# Altium project controller_V1.3.PrjPcb
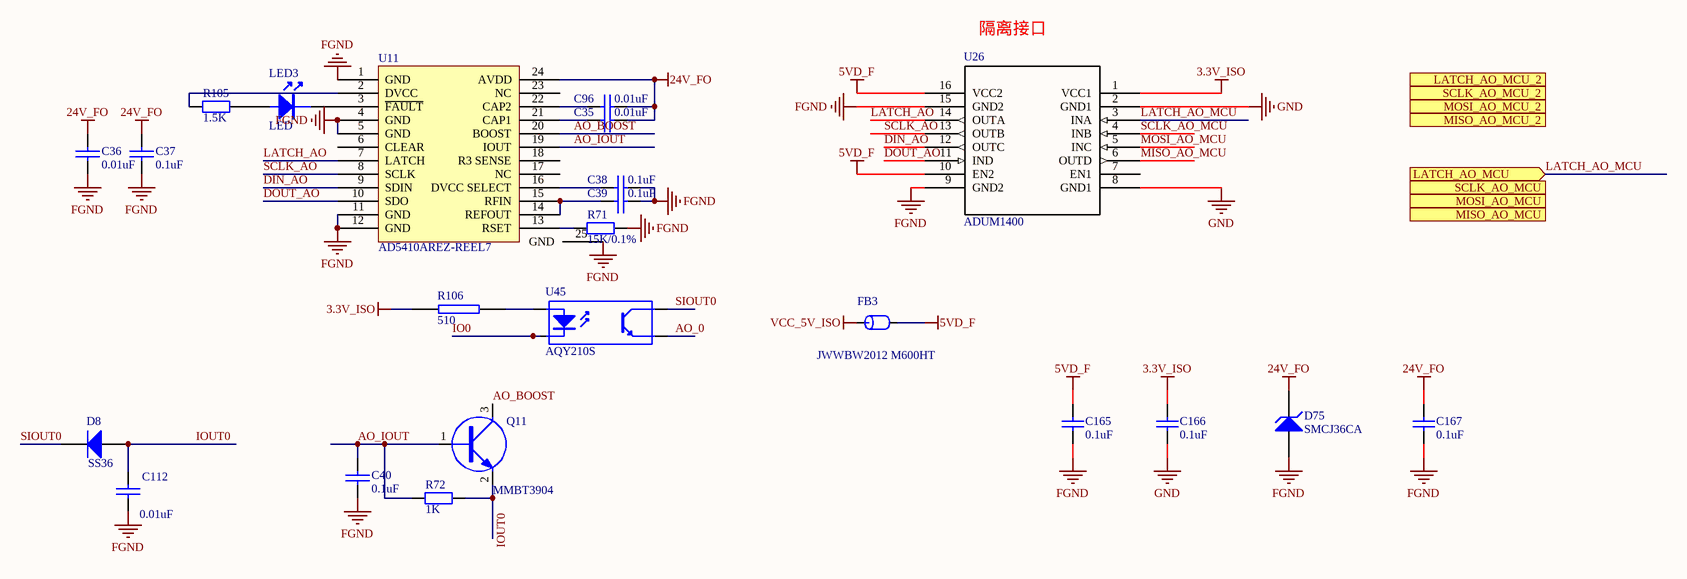
[diagram p0: ao.SchDoc]
5 sheets, 115 parts. Net scope: global (net labels, ports and power ports of the same name join across sheets).
Board file: controller_V1.3.PcbDoc
Sheets:
  ao.SchDoc
  mcu.SchDoc
  pt100.SchDoc
  wire.SchDoc
  power1.SchDoc

## Sheet ao.SchDoc
size A3

### Parts
C35  0.01uF  [0603C]  (no BOM)
C36  0.01uF  [0603C]  (no BOM)
C37  0.1uF  [0603C]  (no BOM)
C38  0.1uF  [0603C]  (no BOM)
C39  0.1uF  [0603C]  (no BOM)
C40  0.1uF  [0603C]  (no BOM)
C96  0.01uF  [0603C]  (no BOM)
C112  0.01uF  [0603C]  (no BOM)
C165  0.1uF  [0603C]  (no BOM)
C166  0.1uF  [0603C]  (no BOM)
C167  0.1uF  [0603C]  (no BOM)
D8  SS36  [sma]  (no BOM)
D75  SMCJ36CA  [SMC]  (no BOM)
FB3  JWWBW2012 M600HT  [0805R]  (no BOM)
LED3  LED  [0603LED]  (no BOM)
Q11  MMBT3904  [SOT23-3]  (no BOM)
R71  15K/0.1%  [0603R]  (no BOM)
R72  1K  [0603R]  (no BOM)
R105  1.5K  [0603R]  (no BOM)
R106  510  [0603R]  (no BOM)
U11  AD5410AREZ-REEL7  [AD5410AREZ-REEL7]  (no BOM)
U26  ADUM1400  [SOIC16]  (no BOM)
U45  AQY210S  [sop4]  (no BOM)

### Ports
LATCH_AO_MCU (in), LATCH_AO_MCU_2 (in), MISO_AO_MCU (out), MISO_AO_MCU_2 (out), MOSI_AO_MCU (in), MOSI_AO_MCU_2 (in), SCLK_AO_MCU (in), SCLK_AO_MCU_2 (in)

### Nets
3.3V_ISO: C166.2 R106.2 U26.1(VCC1)
5VD_F: C165.2 FB3.2 U26.10(EN2) U26.16(VCC2)
24V_FO: C35.2 C36.2 C37.2 C96.2 C167.2 D75.2(K) U11.24(AVDD)
FGND: C36.1 C37.1 C38.2 C39.2 C40.1 C112.1 C165.1 C167.1 D75.1(A) R71.2 U11.1(GND) U11.4(GND) U11.5(GND) U11.11(GND) U11.12(GND) U11.25(GND) U26.9(GND2) U26.15(GND2)
GND: C166.1 U26.2(GND1) U26.8(GND1)
VCC_5V_ISO: FB3.1
AO_0: U45.3(E)
AO_BOOST: Q11.3(C) U11.20(BOOST)
AO_IOUT: C40.2 Q11.1(B) R72.1 U11.19(IOUT)
DIN_AO: U11.9(SDIN) U26.12(OUTC)
DOUT_AO: U11.10(SDO) U26.11(IND)
IO0: U45.2(K)
IOUT0: C112.2 D8.1(A) Q11.2(E) R72.2
LATCH_AO: U11.7(LATCH) U26.14(OUTA)
LATCH_AO_MCU: U26.3(INA) ; port LATCH_AO_MCU
MISO_AO_MCU: U26.6(OUTD)
MOSI_AO_MCU: U26.5(INC)
SCLK_AO: U11.8(SCLK) U26.13(OUTB)
SCLK_AO_MCU: U26.4(INB)
SIOUT0: D8.2(K) U45.4(C)
NetC35_1: C35.1 U11.21(CAP1)
NetC38_1: C38.1 U11.16(DVCC_SELECT)
NetC39_1: C39.1 U11.14(REFOUT) U11.15(RFIN)
NetC96_1: C96.1 U11.22(CAP2)
NetLED3_1: LED3.1 R105.2
NetLED3_2: LED3.2 U11.3(~{FAULT})
NetR71_1: R71.1 U11.13(RSET)
NetR105_1: R105.1 U11.2(DVCC)
NetR106_1: R106.1 U45.1(A)

Not connected (* = marked no-connect by the designer): U11 6(CLEAR) 17(NC) 18(R3_SENSE) 23(NC); U26 7(EN1)

### Notes on the sheet
- 隔离接口

### Library data of the parts
C35-C40 C96 C112 = CAP: Capacitor
C165-C167 = Cap: Capacitor; Published: 8-Jun-2000; LatestRevisionDate: 17-Jul-2002; LatestRevisionNote: Re-released for DXP Platform.; PackageReference: RAD-0.3; Publisher: Altium Limited; PackageDescription: Radial Cap, Thru-Hole; 2 Leads; 0.3 in Pin Spacing; Value: 0.1uF
D8 = Diode 1N4001: 1 Amp General Purpose Rectifier; Published: 8-Jun-2000; LatestRevisionDate: 17-Jul-2002; LatestRevisionNote: Re-released for DXP Platform.; DatasheetVersion: 1998; PackageVersion: Aug-1999; PackageReference: DO-41; Publisher: Altium Limited; Code_JEDEC: DO-204-AL; ComponentLink1Description: Manufacturer Link; ComponentLink1URL: http://www.fairchildsemi.com/; ComponentLink2Description: Datasheet; ComponentLink2URL: http://www.fairchildsemi.com/ds/1N%2F1N4001.pdf
D75 = D Zener: SMBJ36CA; Published: 8-Jun-2000; LatestRevisionDate: 17-Jul-2002; LatestRevisionNote: Re-released for DXP Platform.; PackageReference: DIODE-0.7; Publisher: Altium Limited
FB3 = FB: Part Field 1: 磁珠/0603/1K ohm/100MHz; FB: BLM18BD102SN1(muRata); Text Field1: FB
Q11 = NPN_MMBT3904
R71 R72 R105 = Res0805M
R106 = RES2
U26 = ISO7241C
U45 = Optoisolator1: 4-Pin Phototransistor Optocoupler; Published: 24-Mar-1999; LatestRevisionDate: 04-Mar-2005; LatestRevisionNote: Sch pins 3 & 4 Swapped.; DatasheetVersion: Nov-2003; PackageReference: DIP-4; Publisher: Altium Limited

## Sheet mcu.SchDoc
size A3
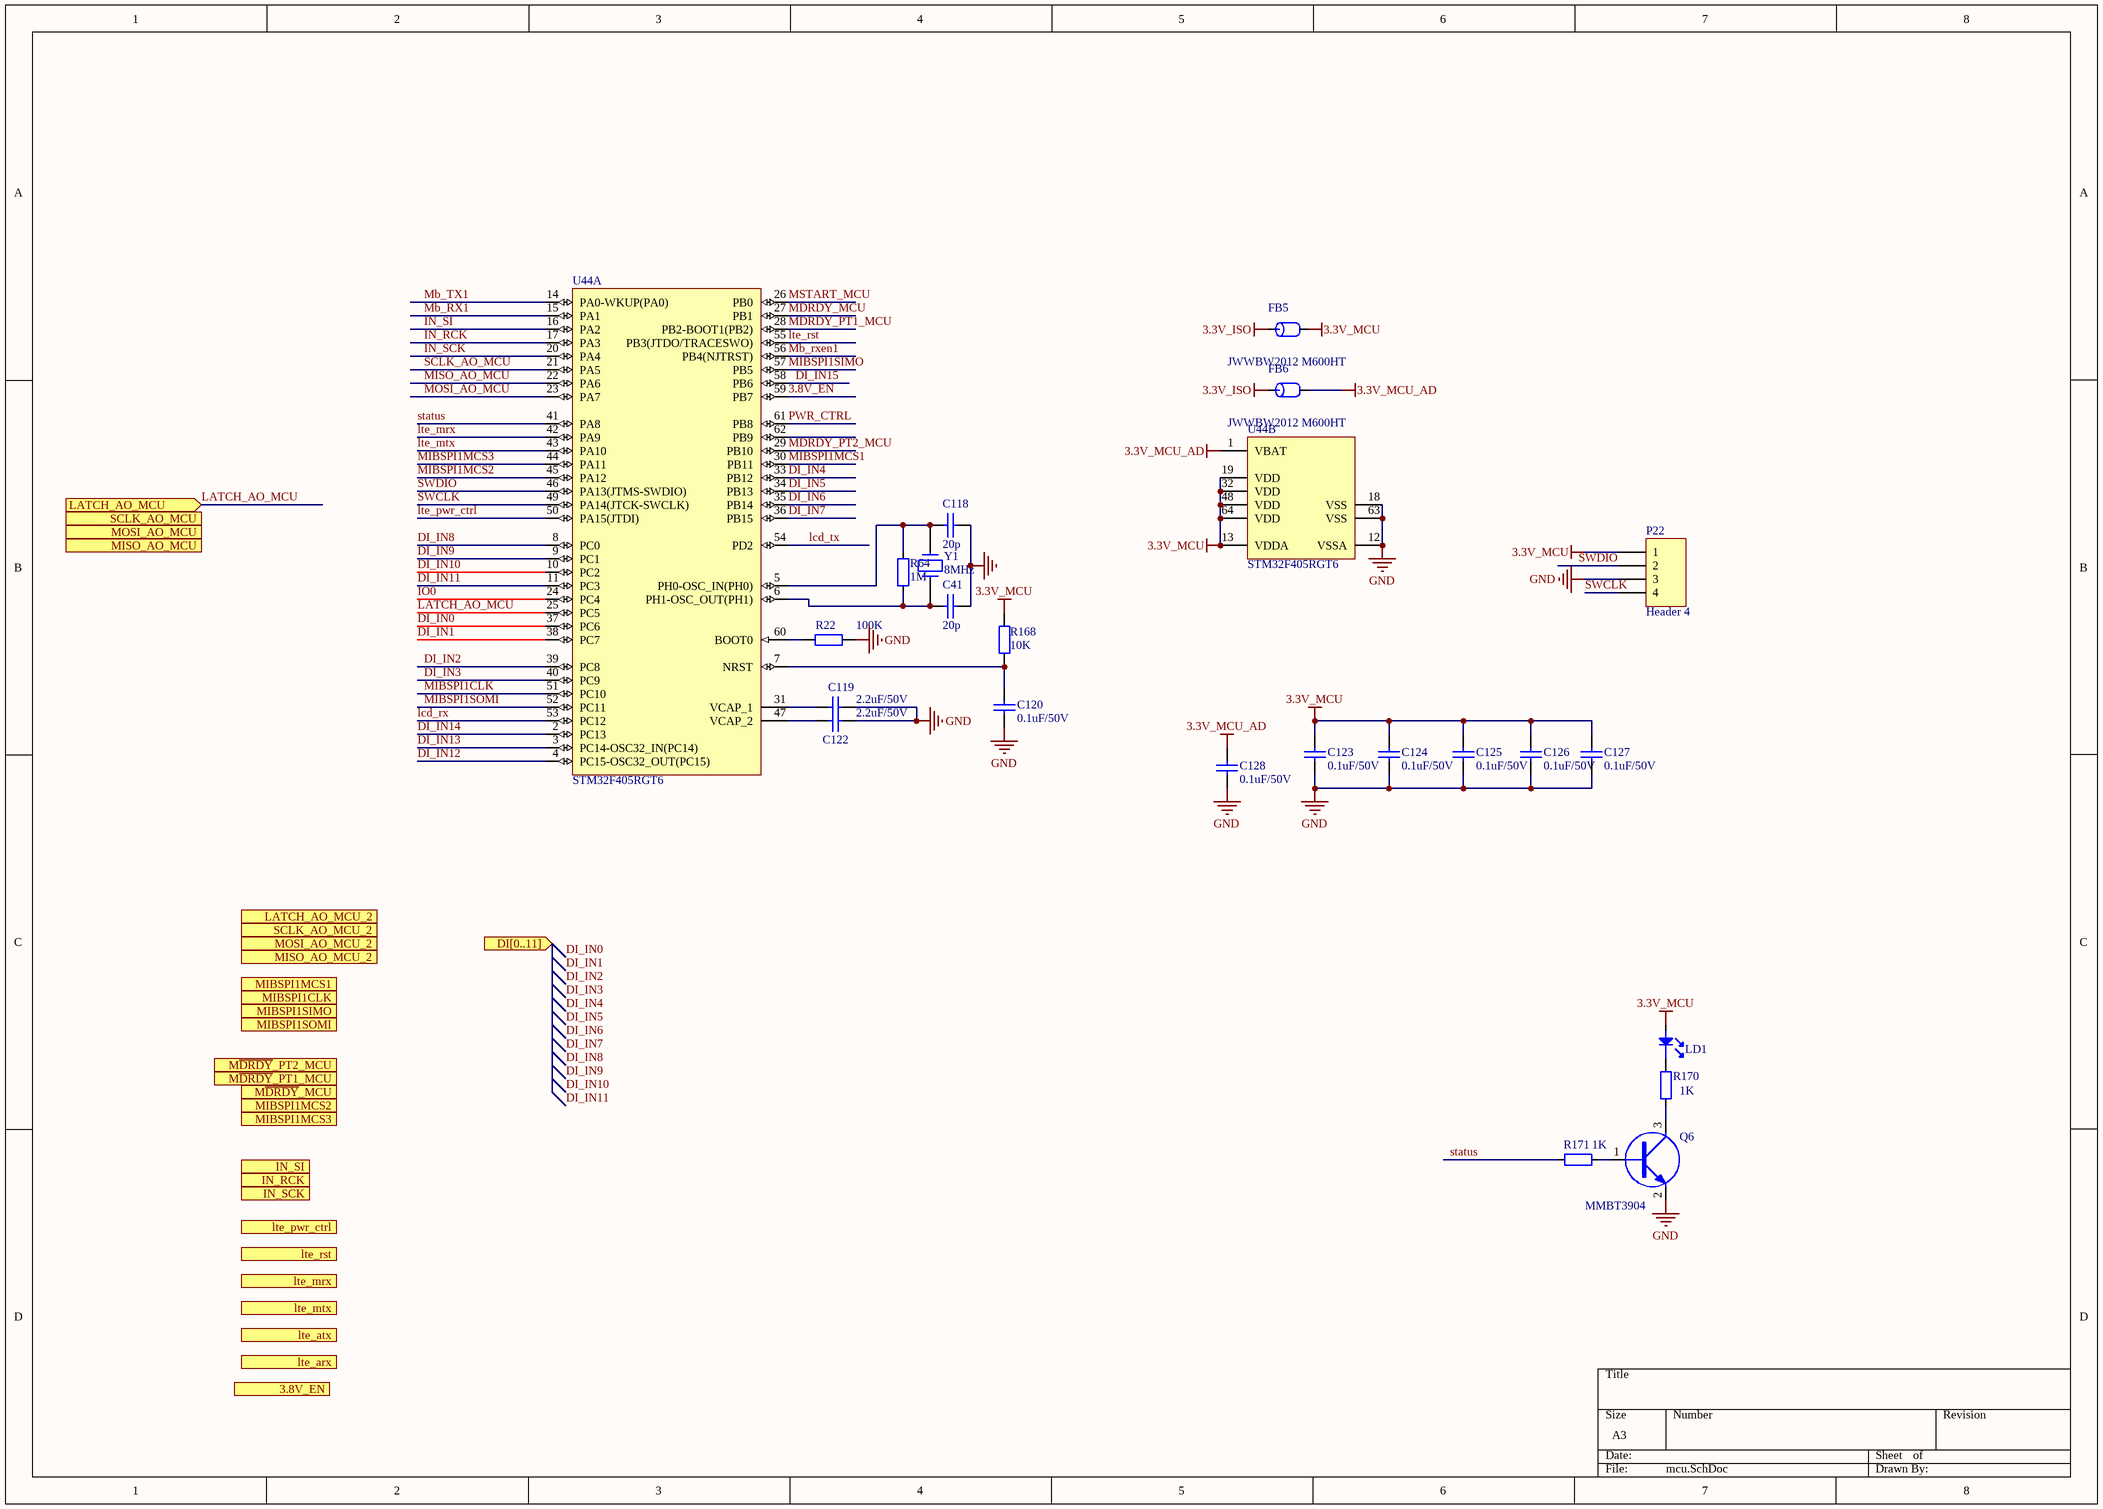
[diagram p1: mcu.SchDoc]

### Parts
C41  20p  [0603c]
C118  20p  [0603c]
C119  2.2uF/50V  [0603C]
C120  0.1uF/50V  [0603C]
C122  2.2uF/50V  [0603C]
C123  0.1uF/50V  [0603C]
C124  0.1uF/50V  [0603C]
C125  0.1uF/50V  [0603C]
C126  0.1uF/50V  [0603C]
C127  0.1uF/50V  [0603C]
C128  0.1uF/50V  [0603C]
FB5  JWWBW2012 M600HT  [0805R]
FB6  JWWBW2012 M600HT  [0805R]
LD1  LED_Green_19-217  [0603led]  (value not drawn)
P22  Header 4  [HDR1X4]
Q6  MMBT3904  [SOT23-3]
R22  100K  [0603R]
R64  1M  [0603R]
R168  10K  [0603R]
R170  1K  [0603r]
R171  1K  [0603r]
U44  STM32F405RGT6  [LQFP-64]  (parts A,B of 2)
Y1  8MHz  [CRAY_5032]

### Ports
3.8V_EN (out), DI[0..11] (in), IN_RCK (out), IN_SCK (out), IN_SI (out), LATCH_AO_MCU (in), LATCH_AO_MCU_2 (out), lte_arx (out), lte_atx (in), lte_mrx (out), lte_mtx (in), lte_pwr_ctrl (out), lte_rst (out), MIBSPI1CLK (in), MIBSPI1MCS1 (in), MIBSPI1MCS2 (in), MIBSPI1MCS3 (in), MIBSPI1SIMO (in), MIBSPI1SOMI (out), MISO_AO_MCU (out), MISO_AO_MCU_2 (in), MOSI_AO_MCU (in), MOSI_AO_MCU_2 (out), M~{DRDY}_MCU (out), M~{DRDY}_PT1_MCU (in), M~{DRDY}_PT2_MCU (in), SCLK_AO_MCU (in), SCLK_AO_MCU_2 (out)

### Nets
3.3V_ISO: FB5.1 FB6.1
3.3V_MCU: C123.2 C124.2 C125.2 C126.2 C127.2 FB5.2 LD1.1 P22.1 R168.2 U44.13(VDDA) U44.19(VDD) U44.32(VDD) U44.48(VDD) U44.64(VDD)
3.3V_MCU_AD: C128.2 FB6.2 U44.1(VBAT)
GND: C41.1 C118.1 C119.1 C120.1 C122.1 C123.1 C124.1 C125.1 C126.1 C127.1 C128.1 P22.3 Q6.2(E) R22.2 U44.12(VSSA) U44.18(VSS) U44.63(VSS)
3.8V_EN: U44.59(PB7)
DI_IN0: U44.37(PC6)
DI_IN1: U44.38(PC7)
DI_IN2: U44.39(PC8)
DI_IN3: U44.40(PC9)
DI_IN4: U44.33(PB12)
DI_IN5: U44.34(PB13)
DI_IN6: U44.35(PB14)
DI_IN7: U44.36(PB15)
DI_IN8: U44.8(PC0)
DI_IN9: U44.9(PC1)
DI_IN10: U44.10(PC2)
DI_IN11: U44.11(PC3)
DI_IN12: U44.4(PC15-OSC32_OUT(PC15))
DI_IN13: U44.3(PC14-OSC32_IN(PC14))
DI_IN14: U44.2(PC13)
DI_IN15: U44.58(PB6)
IN_RCK: U44.17(PA3)
IN_SCK: U44.20(PA4)
IN_SI: U44.16(PA2)
IO0: U44.24(PC4)
LATCH_AO_MCU: U44.25(PC5) ; port LATCH_AO_MCU
lcd_rx: U44.53(PC12)
lcd_tx: U44.54(PD2)
lte_mrx: U44.42(PA9)
lte_mtx: U44.43(PA10)
lte_pwr_ctrl: U44.50(PA15(JTDI))
lte_rst: U44.55(PB3(JTDO/TRACESWO))
Mb_RX1: U44.15(PA1)
Mb_rxen1: U44.56(PB4(NJTRST))
Mb_TX1: U44.14(PA0-WKUP(PA0))
M~{DRDY}_MCU: U44.27(PB1)
M~{DRDY}_PT1_MCU: U44.28(PB2-BOOT1(PB2))
M~{DRDY}_PT2_MCU: U44.29(PB10)
MIBSPI1CLK: U44.51(PC10)
MIBSPI1MCS1: U44.30(PB11)
MIBSPI1MCS2: U44.45(PA12)
MIBSPI1MCS3: U44.44(PA11)
MIBSPI1SIMO: U44.57(PB5)
MIBSPI1SOMI: U44.52(PC11)
MISO_AO_MCU: U44.22(PA6)
MOSI_AO_MCU: U44.23(PA7)
MSTART_MCU: U44.26(PB0)
PWR_CTRL: U44.61(PB8)
SCLK_AO_MCU: U44.21(PA5)
status: R171.1 U44.41(PA8)
SWCLK: P22.4 U44.49(PA14(JTCK-SWCLK))
SWDIO: P22.2 U44.46(PA13(JTMS-SWDIO))
NetC41_2: C41.2 R64.1 U44.6(PH1-OSC_OUT(PH1)) Y1.2
NetC118_2: C118.2 R64.2 U44.5(PH0-OSC_IN(PH0)) Y1.1
NetC119_2: C119.2 U44.31(VCAP_1)
NetC120_2: C120.2 R168.1 U44.7(NRST)
NetC122_2: C122.2 U44.47(VCAP_2)
NetLD1_2: LD1.2 R170.1
NetQ6_1: Q6.1(B) R171.2
NetQ6_3: Q6.3(C) R170.2
NetR22_1: R22.1 U44.60(BOOT0)

Not connected (* = marked no-connect by the designer): U44 62(PB9)

### Notes on the sheet
- Labels drawn without touching a wire or pin: DI_IN0, DI_IN1, DI_IN2, DI_IN3, DI_IN4, DI_IN5, DI_IN6, DI_IN7, DI_IN8, DI_IN9, DI_IN10, DI_IN11

### Library data of the parts
C41 C118 = CAP: Capacitor
C119 C120 C122-C128 = Cap: Capacitor; Value: 22nF; Published: 8-Jun-2000; LatestRevisionDate: 17-Jul-2002; LatestRevisionNote: Re-released for DXP Platform.; PackageReference: RAD-0.3; Publisher: Altium Limited; PackageDescription: Radial Cap, Thru-Hole; 2 Leads; 0.3 in Pin Spacing
FB5 FB6 = FB: as FB3 on sheet ao; Text Field1: FB
LD1 = LED_Green_19-217: 物料主编码(PN): 100000032; Value: 19-217/G7C-AN1P2/3T; ID: 6; 序号: 33; 物料名称: 绿色LED; 物料描述: Other,LED,绿色,0603,1.6X0.8X0.4mm,19-217/G7C-AN1P2/3T; 工作温度: –40°C to 85°C; 制造商: Everlight; 器件等级: ——; 物料类型: 特殊二极管; 规格型号(完整型号): 19-217/G7C-AN1P2/3T
P22 = Header 4: Header, 4-Pin; LatestRevisionDate: 17-Jul-2002; LatestRevisionNote: Re-released for DXP Platform.; Publisher: Altium Limited
Q6 = NPN_MMBT3904
R22 R168 = Res0805M
R64 R170 R171 = RES0603: 物料主编码(PN): 150000040; ID: 233; 序号: 109; 物料名称: 贴片电阻; 精度: ±1%; 规格型号(完整型号): RC1608F103CS/RC0603FR-0710KL; 物料描述: RES,贴片电阻,0603,10k,±1%,1/10W,1.6X0.8X0.45mm,RC1608F103CS/RC0603FR-0710KL; 工作温度: –55°C to 155°C; 制造商: 三星/YAGEO; 器件等级: ——; 物料类型: 表贴电阻; 参数值: 1.00E+04
  R64: Value: 1M
  R170 R171: Value: 1K
U44 = STM32F405RGT6: ARM Cortex-M4 32-bit MCU+FPU, 210 DMIPS, 1024 kB Flash, 192 kB Internal RAM, 51 I/Os, 64-pin LQFP, -40 to 85 degC, Tray; Manufacturer: STMicroelectronics; D/A Converter: 2x12-bit; FLASH Size (Prog) (kB): 1024; I/Os (High Current): 51; Internal RAM Size (kB): 192; Operating Frequency(F) (Processor speed) (MHz): 168; Supply Voltage(Vcc) max (V): 3.6; Supply Voltage(Vcc) min (V): 1.8; DatasheetVersion: Rev. 4; PackageVersion: Rev. 4, 06/2013; PackageReference: LQFP64; PackageDescription: 64-Pin Low Profile Quad Flat Package, 10 x 10 mm Body, 0.5 mm Pitch; Supplier 1: Digi-Key; Supplier Part Number 1: 497-11767-ND; Supplier 2: Farnell; Supplier Part Number 2: 2064363; Supplier 3: Newark; Supplier Part Number 3: 73T2329; Supplier 4: Mouser; Supplier Part Number 4: 511-STM32F405RGT6; Core: ARM Cortex-M4; Packing: Tray; Mounting Technology: Surface Mount; PartNumber: STM32F405RGT6; ComponentLink1Description: Manufacturer URL; ComponentLink1URL: http://www.st.com/web/en/home.html; ComponentLink2Description: Datasheet; ComponentLink2URL: http://www.st.com/st-web-ui/static/active/en/resource/technical/document/datasheet/DM00037051.pdf; ComponentLink3Description: Package Specification; ComponentLink3URL: http://www.st.com/st-web-ui/static/active/en/resource/technical/document/datasheet/DM00037051.pdf
Y1 = CRYSTAL: HC49S-8MHz

## Sheet pt100.SchDoc
size A2
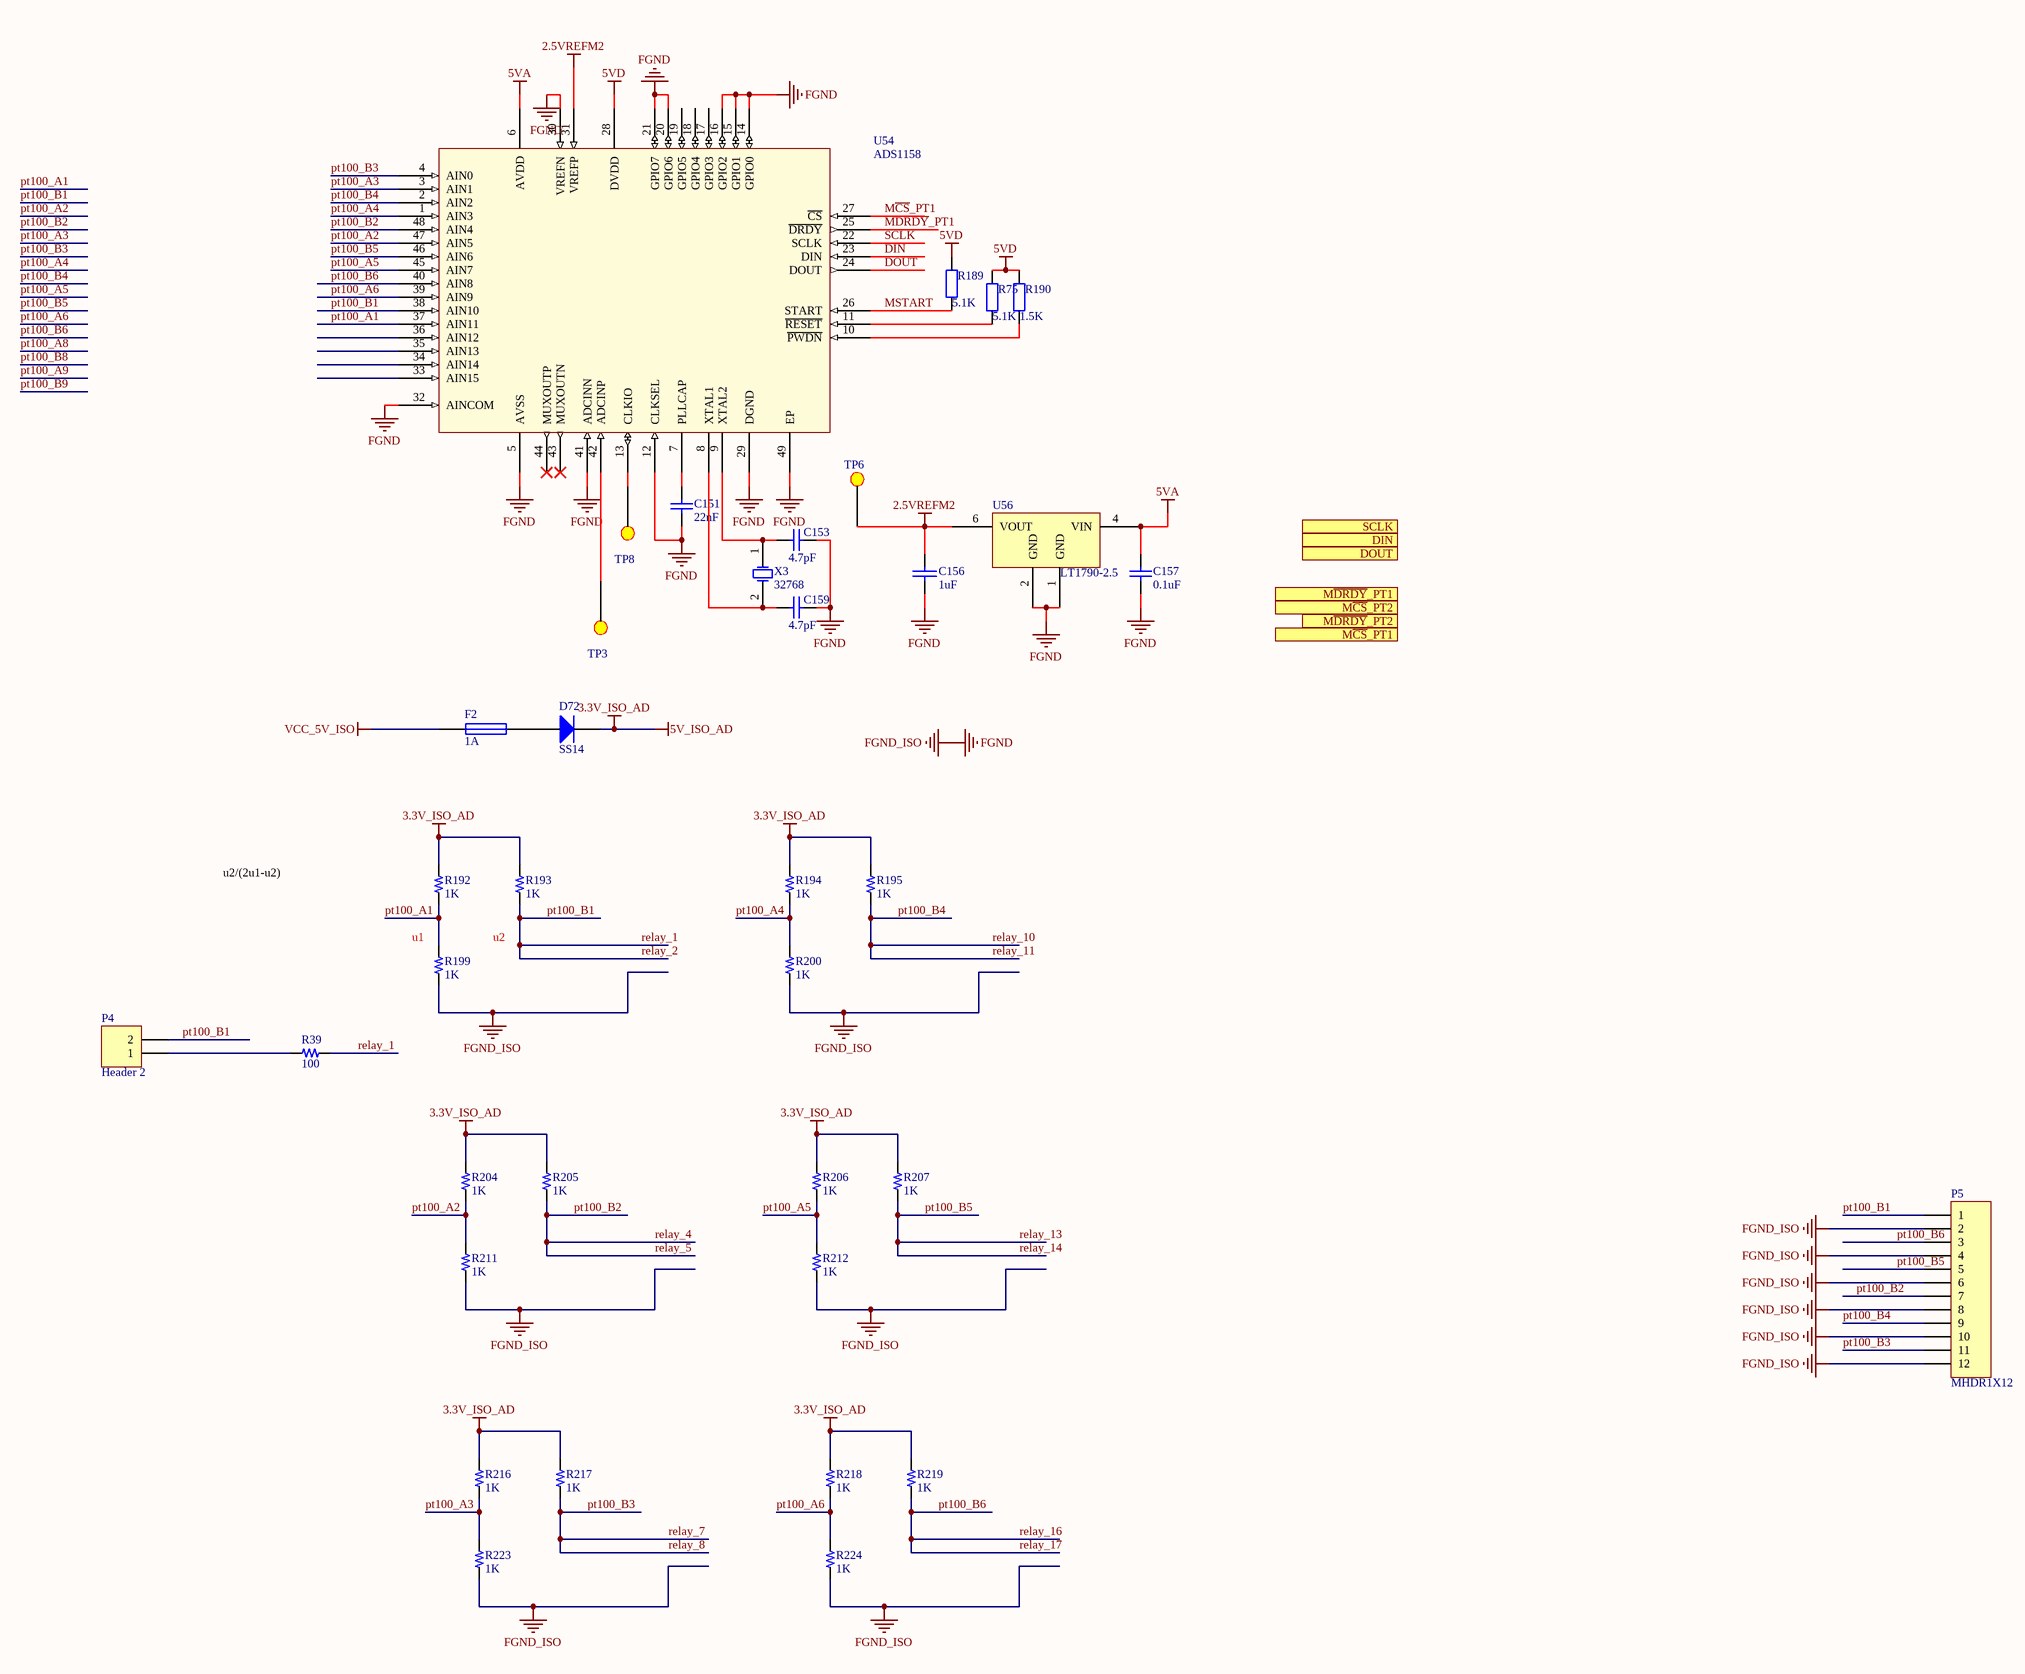
[diagram p2: pt100.SchDoc]

### Parts
C151  22nF  [0805C]
C153  4.7pF  [0603C]
C156  1uF  [0603C]
C157  0.1uF  [0603C]
C159  4.7pF  [0603C]
D72  SS14  [DO-214AC]
F2  1A  [0805r]
P4  Header 2  [HDR1X2]  (no BOM)
P5  MHDR1X12  [2ETYR-5.08-12P-14-100]
R39  100  [0603R]
R75  5.1K  [0603R]
R189  5.1K  [0603R]
R190  1.5K  [0603R]
R192  1K  [0603R]
R193  1K  [0603R]
R194  1K  [0603R]
R195  1K  [0603R]
R199  1K  [0603R]
R200  1K  [0603R]
R204  1K  [0603R]
R205  1K  [0603R]
R206  1K  [0603R]
R207  1K  [0603R]
R211  1K  [0603R]
R212  1K  [0603R]
R216  1K  [0603R]
R217  1K  [0603R]
R218  1K  [0603R]
R219  1K  [0603R]
R223  1K  [0603R]
R224  1K  [0603R]
TP3  TEST_POINT  [TPD]  (value not drawn)
TP6  TEST_POINT  [TPD]  (value not drawn)
TP8  TEST_POINT  [TPD]  (value not drawn)
U54  ADS1158  [S-PVFQN-N48]
U56  LT1790-2.5  [SOT23-6]
X3  32768  [A]

### Ports
DIN (in), DOUT (out), M~{CS}_PT1 (out), M~{CS}_PT2 (out), M~{DRDY}_PT1 (out), M~{DRDY}_PT2 (out), SCLK (in)

### Nets
2.5VREFM2: C156.1 TP6.1 U54.31(VREFP) U56.6(VOUT)
3.3V_ISO_AD: D72.2(K) R192.2 R193.2 R194.2 R195.2 R204.2 R205.2 R206.2 R207.2 R216.2 R217.2 R218.2 R219.2  [also labelled 5V_ISO_AD]
5VA: C157.2 U54.6(AVDD) U56.4(VIN)
5VD: R75.1 R189.1 R190.1 U54.28(DVDD)
FGND: C151.2 C153.2 C156.2 C157.1 C159.2 P5.2 P5.4 P5.6 P5.8 P5.10 P5.12 R199.1 R200.1 R211.1 R212.1 R223.1 R224.1 U54.5(AVSS) U54.12(CLKSEL) U54.14(GPIO0) U54.15(GPIO1) U54.16(GPIO2) U54.20(GPIO6) U54.21(GPIO7) U54.29(DGND) U54.30(VREFN) U54.32(AINCOM) U54.41(ADCINN) U54.49(EP) U56.1(GND) U56.2(GND)  [also labelled FGND_ISO]
VCC_5V_ISO: F2.1
DIN: U54.23(DIN)
DOUT: U54.24(DOUT)
M~{CS}_PT1: U54.27(~{CS})
M~{DRDY}_PT1: U54.25(~{DRDY})
MSTART: R189.2 U54.26(START)
pt100_A1: R192.1 R199.2 U54.37(AIN11)
pt100_A2: R204.1 R211.2 U54.47(AIN5)
pt100_A3: R216.1 R223.2 U54.3(AIN1)
pt100_A4: R194.1 R200.2 U54.1(AIN3)
pt100_A5: R206.1 R212.2 U54.45(AIN7)
pt100_A6: R218.1 R224.2 U54.39(AIN9)
pt100_B1: P4.2 P5.1 R39.1 R193.1 U54.38(AIN10)  [also labelled relay_1, relay_2]
pt100_B2: P5.7 R205.1 U54.48(AIN4)  [also labelled relay_4, relay_5]
pt100_B3: P5.11 R217.1 U54.4(AIN0)  [also labelled relay_7, relay_8]
pt100_B4: P5.9 R195.1 U54.2(AIN2)  [also labelled relay_10, relay_11]
pt100_B5: P5.5 R207.1 U54.46(AIN6)  [also labelled relay_13, relay_14]
pt100_B6: P5.3 R219.1 U54.40(AIN8)  [also labelled relay_16, relay_17]
SCLK: U54.22(SCLK)
NetC151_1: C151.1 U54.7(PLLCAP)
NetC153_1: C153.1 U54.9(XTAL2) X3.1(OSC1)
NetC159_1: C159.1 U54.8(XTAL1) X3.2(OSC2)
NetD72_1: D72.1(A) F2.2
NetP4_1: P4.1 R39.2
NetR75_2: R75.2 U54.11(~{RESET})
NetR190_2: R190.2 U54.10(~{PWDN})
NetTP3_1: TP3.1 U54.42(ADCINP)
NetTP8_1: TP8.1 U54.13(CLKIO)

Not connected (* = marked no-connect by the designer): U54 17(GPIO3) 18(GPIO4) 19(GPIO5) 33(AIN15) 34(AIN14) 35(AIN13) 36(AIN12) 43(MUXOUTN)* 44(MUXOUTP)*; U56 3(DNC) 5(DNC)

### Notes on the sheet
- u2/(2u1-u2)
- (near R199) u1
- u2

### Library data of the parts
C151 C153 C157 = Cap: Capacitor; Published: 8-Jun-2000; LatestRevisionDate: 17-Jul-2002; LatestRevisionNote: Re-released for DXP Platform.; PackageReference: RAD-0.3; Publisher: Altium Limited; PackageDescription: Radial Cap, Thru-Hole; 2 Leads; 0.3 in Pin Spacing
  C157: Value: 0.1uF
C156 = CAP: Capacitor
C159 = Cap: Capacitor; Value: 6.8pF; Published: 8-Jun-2000; LatestRevisionDate: 17-Jul-2002; LatestRevisionNote: Re-released for DXP Platform.; PackageReference: RAD-0.3; Publisher: Altium Limited; PackageDescription: Radial Cap, Thru-Hole; 2 Leads; 0.3 in Pin Spacing
D72 = Diode: Default Diode; Published: 8-Jun-2000; LatestRevisionDate: 17-Jul-2002; LatestRevisionNote: Re-released for DXP Platform.; PackageVersion: Sep-1996; PackageReference: SMC; Publisher: Altium Limited; Code_JEDEC: DO-214-AB
F2 = Fuse 1: Fuse; Published: 8-Jun-2000; LatestRevisionDate: 17-Jul-2002; LatestRevisionNote: Re-released for DXP Platform.; PackageReference: PIN-W2/E2.8; Publisher: Altium Limited; PackageDescription: Thru-Hole; 2 Leads
P4 = Header 2: Header, 2-Pin; LatestRevisionDate: 17-Jul-2002; LatestRevisionNote: Re-released for DXP Platform.; Publisher: Altium Limited
P5 = MHDR1X12: Header, 12-Pin; LatestRevisionDate: 17-Jul-2002; LatestRevisionNote: Re-released for DXP Platform.; Publisher: Altium Limited
R39 R192-R195 R199 R200 R204-R207 R211 R212 R216-R219 R223 R224 = R
R75 R189 R190 = Res0805M
U54 = ADS1158: 16-Channel, 16-Bit Analog-to-Digital Converter
U56 = LT1790-2.5: 2.5V Micropower SOT-23  Low Dropout Reference
X3 = XTAL: Crystal Oscillator; Published: 8-Jun-2000; LatestRevisionDate: 17-Jul-2002; LatestRevisionNote: Re-released for DXP Platform.; PackageReference: R38; Publisher: Altium Limited

## Sheet wire.SchDoc
size A3
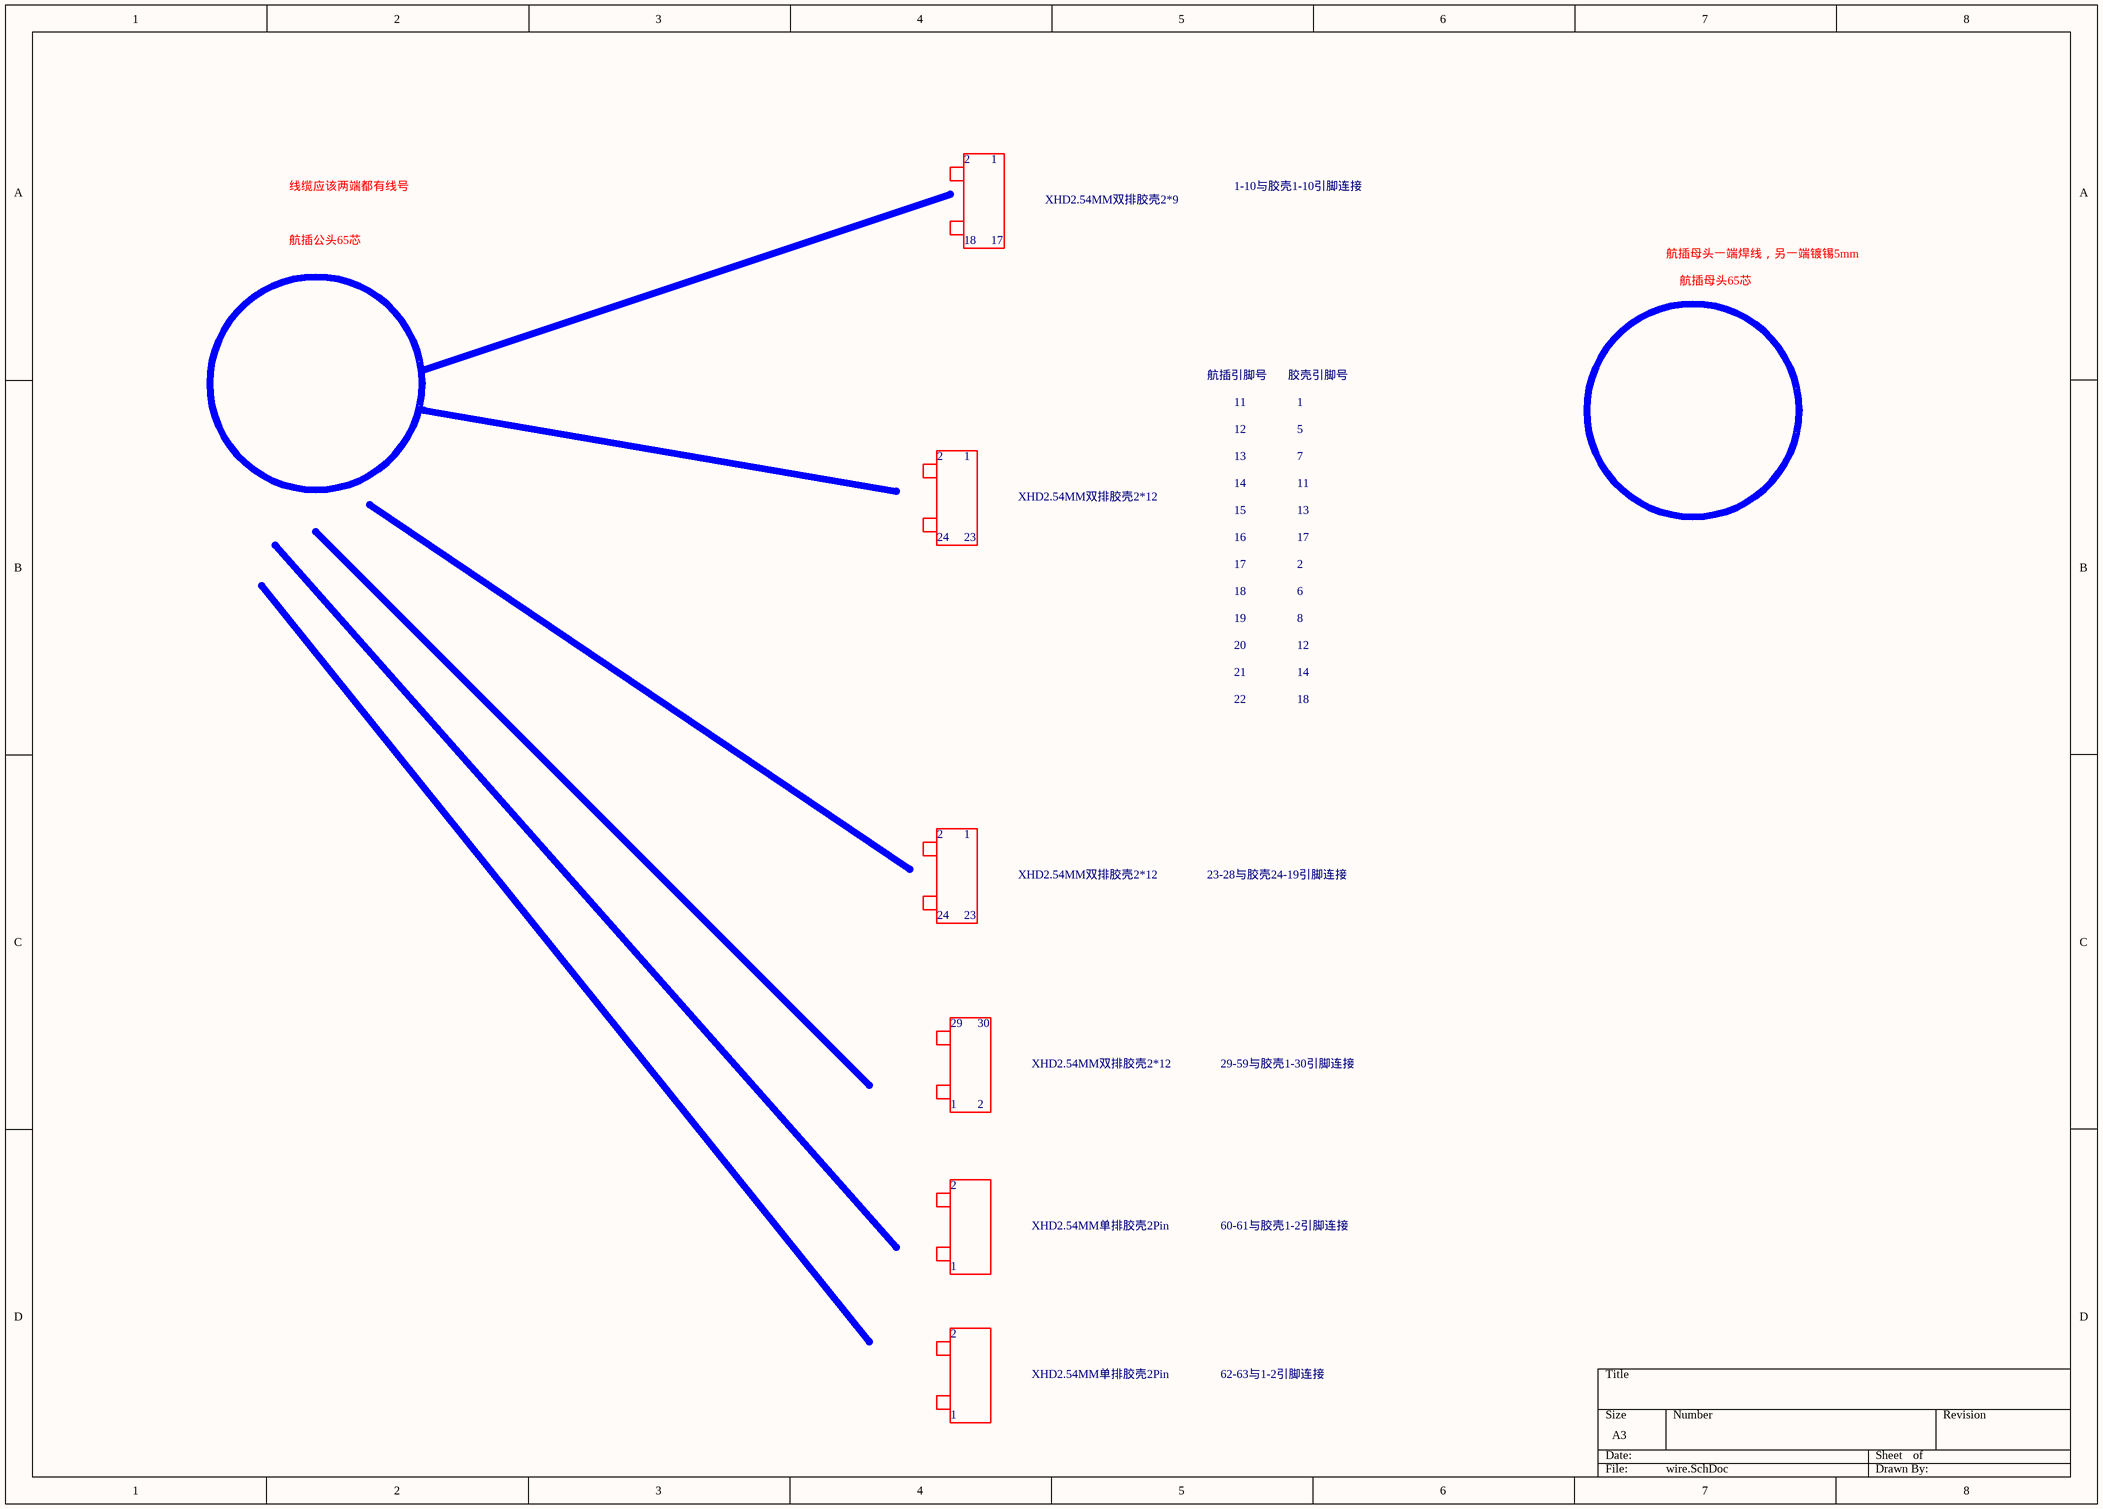
[diagram p3: wire.SchDoc]

### Notes on the sheet
- 2
- 1
- 航插公头65芯
- 线缆应该两端都有线号
- 18
- 17
- XHD2.54MM双排胶壳2*9
- 1-10与胶壳1-10引脚连接
- 航插母头一端焊线，另一端镀锡5mm
- 航插母头65芯
- 航插引脚号       胶壳引脚号
- 11                 1
- 12                 5
- XHD2.54MM双排胶壳2*12
- 13                 7
- 14                 11
- 15                 13
- 24
- 23
- 16                 17
- 17                 2
- 18                 6
- 19                 8
- 20                 12
- 21                 14
- 22                 18
- 23-28与胶壳24-19引脚连接
- 29
- 30
- 29-59与胶壳1-30引脚连接
- XHD2.54MM单排胶壳2Pin
- 60-61与胶壳1-2引脚连接
- 62-63与1-2引脚连接

## Sheet power1.SchDoc
size A2
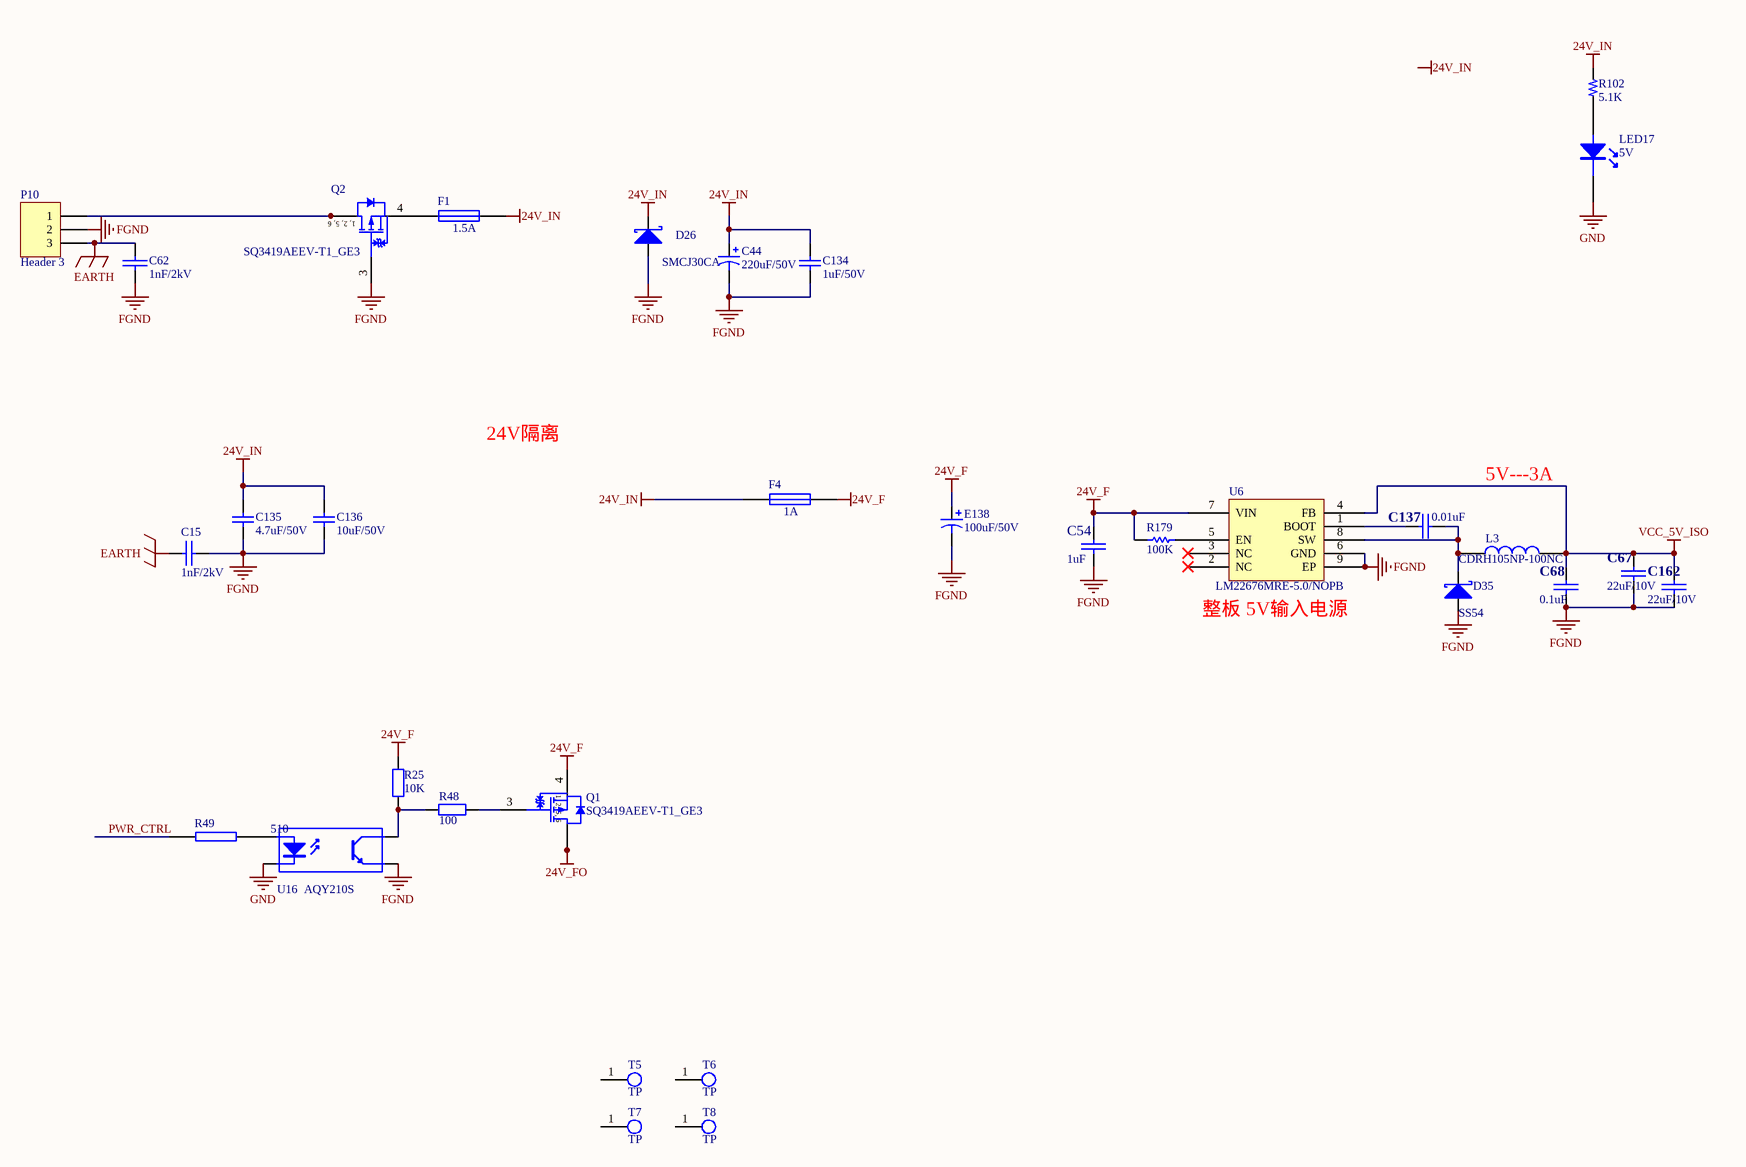
[diagram p4: power1.SchDoc]

### Parts
C15  1nF/2kV  [1206C]
C44  220uF/50V  [Φ10×10]
C54  1uF  [0603C]
C62  1nF/2kV  [1206C]
C67  22uF/10V  [1210C]
C68  0.1uF  [0603C]
C134  1uF/50V  [1210C]
C135  4.7uF/50V  [1210C]
C136  10uF/50V  [1210C]
C137  0.01uF  [0603C]
C162  22uF/10V  [1210C]
D26  SMCJ30CA  [SMC]
D35  SS54  [SMC]
E138  100uF/50V  [Φ10×10]
F1  1.5A  [1812-F]
F4  1A  [1812-F]
L3  CDRH105NP-100NC  [CDRH105]
LED17  5V  [0603LED]
P10  Header 3  [2ETYR-5.08-03P-14-100]
Q1  SQ3419AEEV-T1_GE3  [VISH-TSOP-6_V]
Q2  SQ3419AEEV-T1_GE3  [VISH-TSOP-6_V]
R25  10K  [0603R]
R48  100  [0603R]
R49  510  [0603R]
R102  5.1K  [0603R]
R179  100K  [0603R]
T5  TP  [m2.5]
T6  TP  [m2.5]
T7  TP  [m2.5]
T8  TP  [m2.5]
U6  LM22676MRE-5.0/NOPB  [SOP127P600X168_HS-8N]
U16  AQY210S  [sop4]

### Nets
24V_F: C54.2 E138.1 F4.2 Q1.4(S) R25.2 R179.2 U6.7(VIN)
24V_FO: Q1.1(D) Q1.2(D) Q1.5(D) Q1.6(D)
24V_IN: C44.1 C134.2 C135.2 C136.2 D26.2(K) F1.2 F4.1 R102.2
EARTH: C15.2 C62.2 P10.3
FGND: C15.1 C44.2 C54.1 C62.1 C67.2 C68.2 C134.1 C135.1 C136.1 C162.2 D26.1(A) D35.1(A) E138.2 P10.2 Q2.3(G) U6.6(GND) U6.9(EP) U16.3(E)
GND: LED17.2 U16.2(K)
VCC_5V_ISO: C67.1 C68.1 C162.1 L3.2 U6.4(FB)
PWR_CTRL: R49.2
NetC137_1: C137.1 D35.2(K) L3.1 U6.8(SW)
NetC137_2: C137.2 U6.1(BOOT)
NetF1_1: F1.1 Q2.4(S)
NetLED17_1: LED17.1 R102.1
NetP10_1: P10.1 Q2.1(D) Q2.2(D) Q2.5(D) Q2.6(D)
NetQ1_3: Q1.3(G) R48.1
NetR25_1: R25.1 R48.2 U16.4(C)
NetR49_1: R49.1 U16.1(A)
NetR179_1: R179.1 U6.5(EN)

Not connected (* = marked no-connect by the designer): T5 1; T6 1; T7 1; T8 1; U6 2(NC)* 3(NC)*

### Notes on the sheet
- 24V隔离
- 5V---3A
- (near U6) 整板 5V输入电源
- Labels drawn without touching a wire or pin: 24V_IN
- (in symbol SQ3419AEEV-T1_GE3) 1, 2, 5, 6

### Library data of the parts
C15 C54 C62 C67 C68 C137 C162 = CAP: Capacitor
C44 = Cap Pol1: Polarized Capacitor (Radial); Published: 8-Jun-2000; LatestRevisionDate: 17-Jul-2002; LatestRevisionNote: Re-released for DXP Platform.; PackageReference: RB7.6-15; Publisher: Altium Limited; Value: 220uF/50V
C134-C136 = Cap: Capacitor; Value: 22nF; Published: 8-Jun-2000; LatestRevisionDate: 17-Jul-2002; LatestRevisionNote: Re-released for DXP Platform.; PackageReference: RAD-0.3; Publisher: Altium Limited; PackageDescription: Radial Cap, Thru-Hole; 2 Leads; 0.3 in Pin Spacing
D26 D35 = DIODE S: Schottky Diode
E138 = Cap Pol1: Polarized Capacitor (Radial); Value: 100pF; Published: 8-Jun-2000; LatestRevisionDate: 17-Jul-2002; LatestRevisionNote: Re-released for DXP Platform.; PackageReference: RB7.6-15; Publisher: Altium Limited
F1 F4 = Fuse 1: Fuse; Published: 8-Jun-2000; LatestRevisionDate: 17-Jul-2002; LatestRevisionNote: Re-released for DXP Platform.; PackageReference: PIN-W2/E2.8; Publisher: Altium Limited; PackageDescription: Thru-Hole; 2 Leads
L3 = INDUCTOR
LED17 = LED
P10 = Header 3: Header, 3-Pin; LatestRevisionDate: 17-Jul-2002; LatestRevisionNote: Re-released for DXP Platform.; Publisher: Altium Limited
Q1 Q2 = SQ3419AEEV-T1_GE3: Automotive P-Channel MOSFET, 6.9 A, 40 V, -55 to 175 degC, 6-Pin TSOP, RoHS, Tape and Reel; Manufacturer: International Rectifier; Rated Power Dissipation: 2W; Qg Gate Charge: 25nC; Drain-to-Source Voltage [Vdss]: 40V; Drain-Source On Resistance-Max: 112mO; Channel Type: P-Channel; Package Description: 6-Pin Thin Small Outline Package, Body 3 x 1.65 mm, Pitch 1.00 mm; Datasheet URL: https://www.vishay.com/docs/65332/sq3419aeev.pdf; Mounting Technology: SurfaceMount; Package Reference: TSOP-6; Manufacturer URL: https://www.vishay.com/; Datasheet Version: 04/2010
R25 R48 = Res0805M
R49 = RES2
R102 = R
R179 = Res1: Resistor; Published: 8-Jun-2000; LatestRevisionDate: 17-Jul-2002; LatestRevisionNote: Re-released for DXP Platform.; PackageReference: AXIAL-0.3; Publisher: Altium Limited
U6 = LM22676MR-5.0
U16 = Optoisolator1: 4-Pin Phototransistor Optocoupler; Published: 24-Mar-1999; LatestRevisionDate: 04-Mar-2005; LatestRevisionNote: Sch pins 3 & 4 Swapped.; DatasheetVersion: Nov-2003; PackageReference: DIP-4; Publisher: Altium Limited

## Nets that join several sheets
3.3V_ISO: ao (C166.2 R106.2 U26.1), mcu (FB5.1 FB6.1)
24V_FO: ao (7 pins), power1 (Q1.1 Q1.2 Q1.5 Q1.6)
FGND: ao (18 pins), pt100 (31 pins), power1 (18 pins)
GND: ao (C166.1 U26.2 U26.8), mcu (17 pins), power1 (LED17.2 U16.2)
VCC_5V_ISO: ao (FB3.1), pt100 (F2.1), power1 (5 pins)
IO0: ao (U45.2), mcu (U44.24)
LATCH_AO_MCU: ao (U26.3), mcu (U44.25)
MISO_AO_MCU: ao (U26.6), mcu (U44.22)
MOSI_AO_MCU: ao (U26.5), mcu (U44.23)
PWR_CTRL: mcu (U44.61), power1 (R49.2)
SCLK_AO_MCU: ao (U26.4), mcu (U44.21)